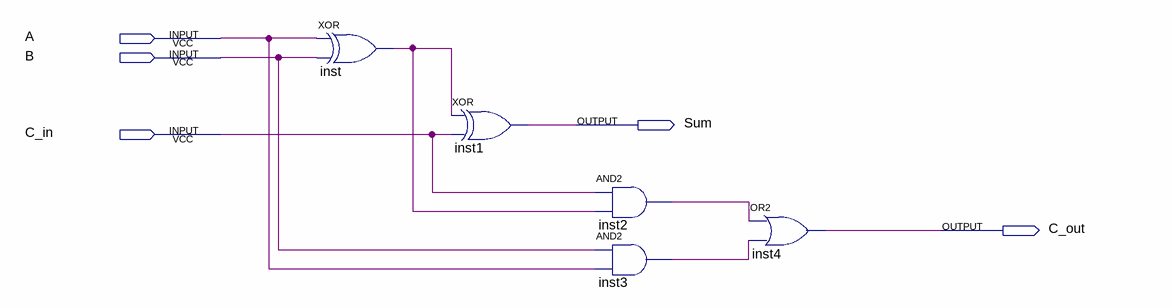
[diagram p0: schematic sheet]
// Quartus schematic FullAdder2bit.bdf as structural Verilog: 5 symbols, 5 pins
module FullAdder2bit (
  input  A,
  input  B,
  input  C_in,
  output Sum,
  output C_out
);

  wire inst2_out, inst3_out, inst_out;

  xor inst (inst_out, A, B);
  xor inst1 (Sum, inst_out, C_in);
  and inst2 (inst2_out, C_in, inst_out);
  and inst3 (inst3_out, B, A);
  or inst4 (C_out, inst2_out, inst3_out);
endmodule
